# Altium schematic sheet zulu_a7_4.SchDoc
size 240 x 314 mm; Author: Christian Tambe; VERSION#: 1.0; Origin: Eagle; OriginPath: C:\Users\tambe\Documents\Electronics\Zulu_A7\Zulu_Altrium\zulu_a7.sch; OriginSheet: 5; OriginDescription: FT2232HL, JTAG, CLOCK
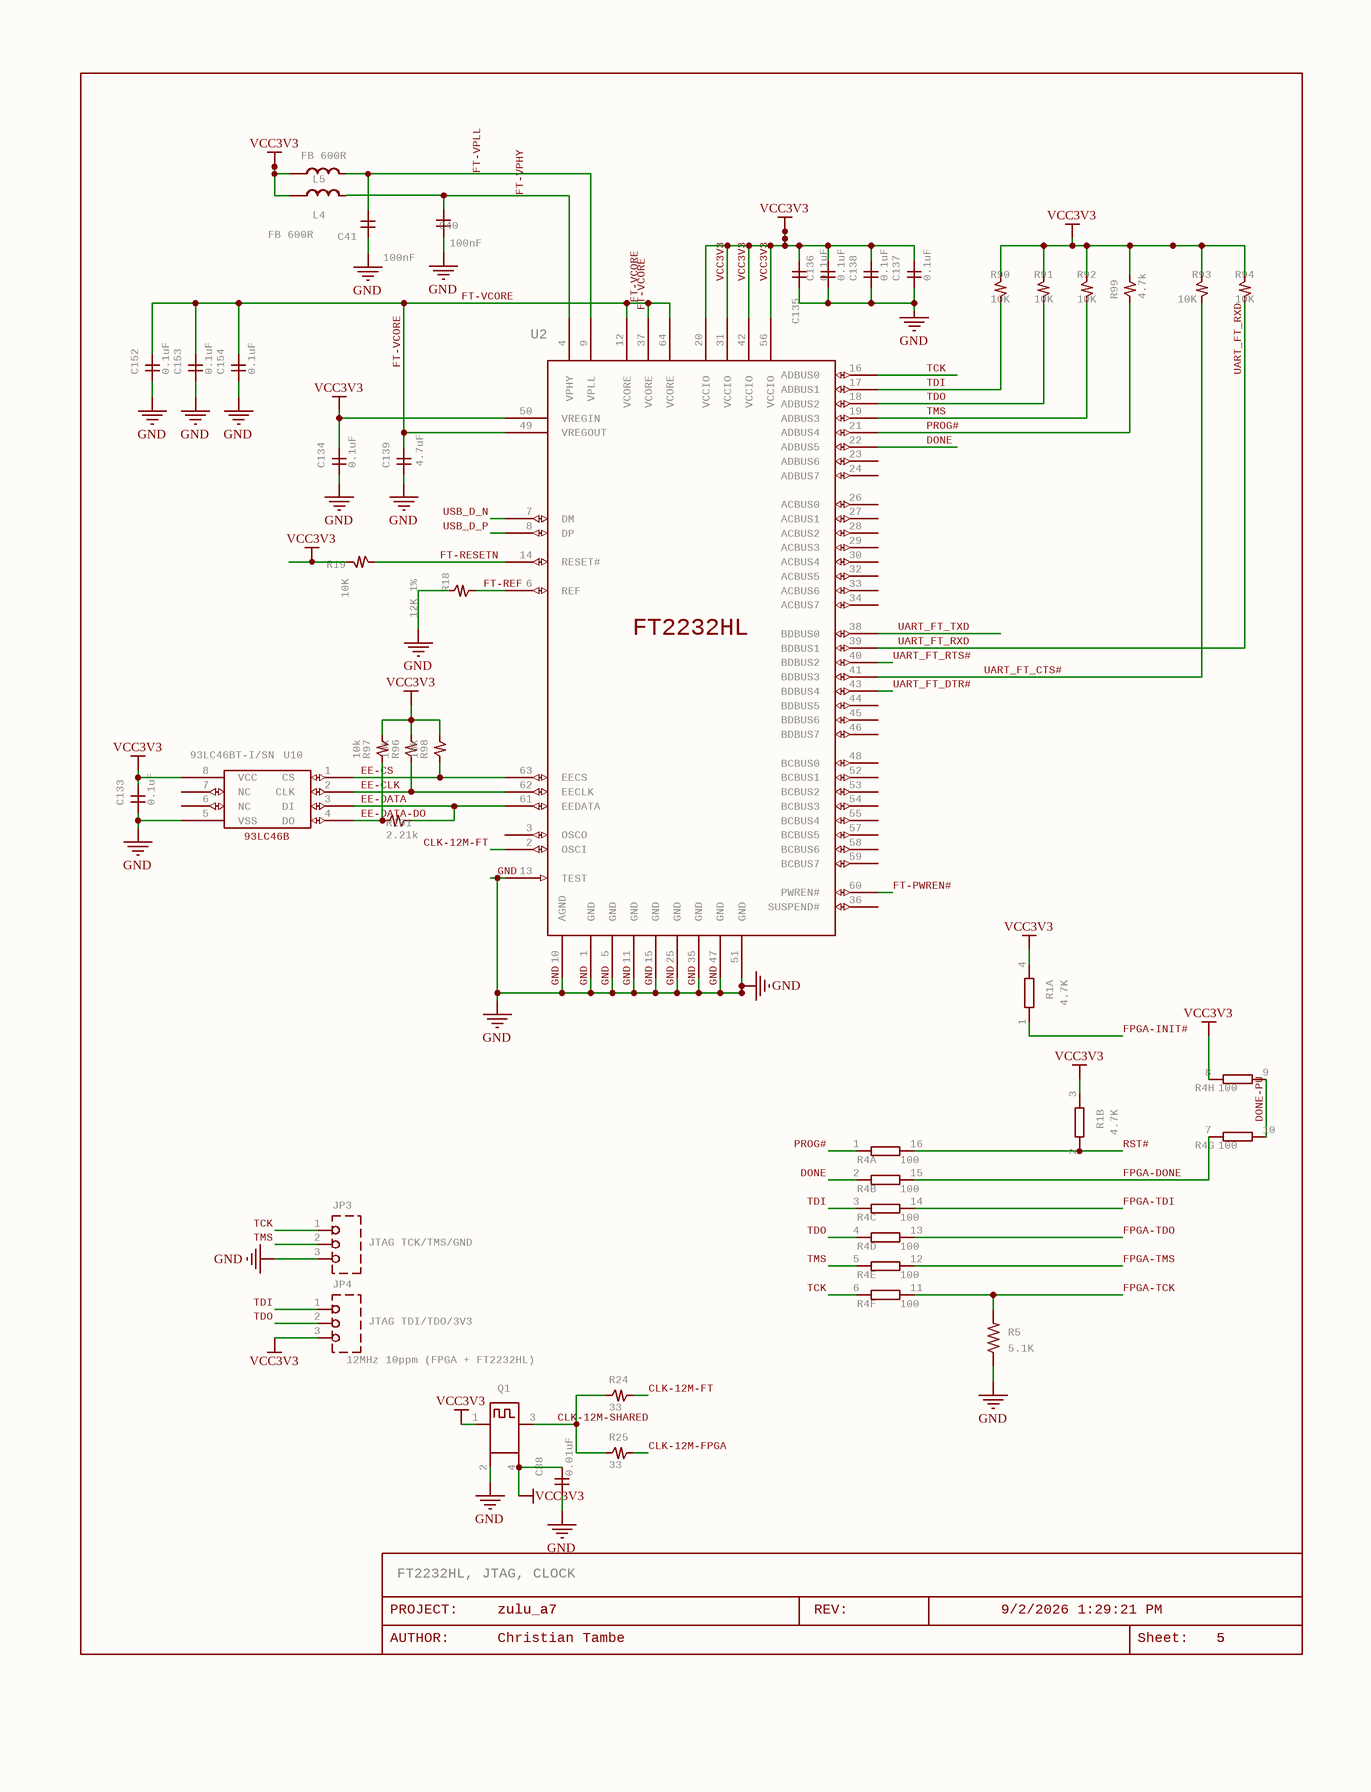
[diagram p0: zulu_a7_4.SchDoc]

## Parts
C38  0.01uF  [C0201]
C40  100nF  [C0201]
C41  100nF  [C0201]
C133  0.1uF  [C0201]
C134  0.1uF  [C0201]
C135  0.1uF  [C0201]
C136  0.1uF  [C0201]
C137  0.1uF  [C0201]
C138  0.1uF  [C0201]
C139  4.7uF  [C0402]
C152  0.1uF  [C0201]
C153  0.1uF  [C0201]
C154  0.1uF  [C0201]
FRAME4  LAST_DATE_TIME: 9/2/2026 1:29:21 PM  Sheet: Sheet:  SHEET: 5  REV: REV:  PROJECT: PROJECT:  DRAWING_NAME: zulu_a7  AUTHOR: Christian Tambe  (hidden comment: DOCFIELD)  (graphical)
JP3  JTAG TCK/TMS/GND  [1X03-NOSILK]
JP4  JTAG TDI/TDO/3V3  [1X03-NOSILK]
L4  FB 600R  [IND0603]
L5  FB 600R  [IND0603]
Q1  12MHz 10ppm (FPGA + FT2232HL)  [32X25]
R1  4.7K  [742C043]  (parts A,B of 2)
R4  100  [742C163]  (parts A,B,C,D,E,F,G,H of 8)
R5  5.1K  [R0201]
R18  12K 1%  [R0402]
R19  10K  [R0201]
R24  33  [R0201]
R25  33  [R0201]
R90  10K  [R0201]
R91  10K  [R0201]
R92  10K  [R0201]
R93  10K  [R0201]
R94  10K  [R0201]
R96  10k  [R0201]
R97  10k  [R0201]
R98  10k  [R0201]
R99  4.7k  [R0201]
R101  2.21k  [R0201]
U2  FT2232HL USB-UART/JTAG Bridge  [FT2232HL-LQFP64]  (value not drawn)
U10  93LC46BT-I/SN  [SPI-8_SOIC_150]

## Nets
GND: C38.1 C40.1 C41.1 C133.1 C134.1 C135.1 C136.1 C137.1 C138.1 C139.1 C152.1 C153.1 C154.1 JP3.3 Q1.2 R5.1 R18.1 U2.1(GND) U2.5(GND) U2.10(AGND) U2.11(GND) U2.13(TEST) U2.15(GND) U2.25(GND) U2.35(GND) U2.47(GND) U2.51(GND) U10.5(VSS)
VCC3V3: C38.2 C133.2 C134.2 C135.2 C136.2 C137.2 C138.2 JP4.3 L4.2 L5.2 Q1.1 Q1.4 R1.3 R1.4 R4.8 R19.2 R90.2 R91.2 R92.2 R93.2 R94.2 R96.2 R97.2 R98.2 R99.2 U2.20(VCCIO) U2.31(VCCIO) U2.42(VCCIO) U2.50(VREGIN) U2.56(VCCIO) U10.8(VCC)
CLK-12M-FPGA: R25.2
CLK-12M-FT: R24.2 U2.2(OSCI)
CLK-12M-SHARED: Q1.3 R24.1 R25.1
DONE: R4.2 U2.22(ADBUS5)
DONE-PU: R4.9 R4.10
EE-CLK: R96.1 U2.62(EECLK) U10.2(CLK)
EE-CS: R98.1 U2.63(EECS) U10.1(CS)
EE-DATA: R101.2 U2.61(EEDATA) U10.3(DI)
EE-DATA-DO: R97.1 R101.1 U10.4(DO)
FPGA-DONE: R4.7 R4.15
FPGA-INIT#: R1.1
FPGA-TCK: R4.11 R5.2
FPGA-TDI: R4.14
FPGA-TDO: R4.13
FPGA-TMS: R4.12
FT-PWREN#: U2.60(PWREN#)
FT-REF: R18.2 U2.6(REF)
FT-RESETN: R19.1 U2.14(RESET#)
FT-VCORE: C139.2 C152.2 C153.2 C154.2 U2.12(VCORE) U2.37(VCORE) U2.49(VREGOUT) U2.64(VCORE)
FT-VPHY: C40.2 L4.1 U2.4(VPHY)
FT-VPLL: C41.2 L5.1 U2.9(VPLL)
PROG#: R4.1 R99.1 U2.21(ADBUS4)
RST#: R1.2 R4.16
TCK: JP3.1 R4.6 U2.16(ADBUS0)
TDI: JP4.1 R4.3 R90.1 U2.17(ADBUS1)
TDO: JP4.2 R4.4 R91.1 U2.18(ADBUS2)
TMS: JP3.2 R4.5 R92.1 U2.19(ADBUS3)
UART_FT_CTS#: R93.1 U2.41(BDBUS3)
UART_FT_DTR#: U2.43(BDBUS4)
UART_FT_RTS#: U2.40(BDBUS2)
UART_FT_RXD: R94.1 U2.39(BDBUS1)
UART_FT_TXD: U2.38(BDBUS0)
USB_D_N: U2.7(DM)
USB_D_P: U2.8(DP)

Not connected (* = marked no-connect by the designer): U2 3(OSCO) 23(ADBUS6) 24(ADBUS7) 26(ACBUS0) 27(ACBUS1) 28(ACBUS2) 29(ACBUS3) 30(ACBUS4) 32(ACBUS5) 33(ACBUS6) 34(ACBUS7) 36(SUSPEND#) 44(BDBUS5) 45(BDBUS6) 46(BDBUS7) 48(BCBUS0) 52(BCBUS1) 53(BCBUS2) 54(BCBUS3) 55(BCBUS4) 57(BCBUS5) 58(BCBUS6) 59(BCBUS7); U10 6(NC) 7(NC)

## Notes on the sheet
- (near FRAME4) FT2232HL, JTAG, CLOCK
- (near FRAME4) AUTHOR:

## Library data of the parts
C38 = C-GENERICC0201: CAPACITOR, generic non-polarized, horizontal pins; GateName_1: G$1; SymbolName_1: C-GENERIC-H; MANF: Murata; MANF#: GRM033R71E103KE14D; NOTE: 0402 -> 0201 on U2's support. 50V drops to 25V, which is still far over what a 3.3V rail needs -- the 50V part was over-specified. Confirm the MPN suffix before ordering.; SPEC: X7R 25V +-10%, 0.30 mm max; DeviceName: C0201; LibraryName: rcl; DeviceSetName: C-GENERIC
C40 C41 C133-C138 = C-GENERICC0201: CAPACITOR, generic non-polarized, horizontal pins; GateName_1: G$1; SymbolName_1: C-GENERIC-H; MANF: Murata; MANF#: GRM033R61A104KE15D; NOTE: 0402 -> 0201 on U2's support. The DIELECTRIC AND VOLTAGE BOTH CHANGE: X7R 16V becomes X5R 10V, because 0201 at this capacitance is an X5R part. X5R narrows the temperature range to -55..+85 C from X7R's +125, which suits this board but is not a like-for-like swap. At 0.1 uF the DC bias derating is mild, unlike the 0.47 uF on sheet 7. Confirm the MPN suffix against Murata's data before ordering.; SPEC: X5R 10V +-10%, 0.30 mm max; DeviceName: C0201; LibraryName: rcl; DeviceSetName: C-GENERIC
C139 = C-GENERICC0402: CAPACITOR, generic non-polarized, horizontal pins; GateName_1: G$1; SymbolName_1: C-GENERIC-H; MANF: Taiyo Yuden; MANF#: MSASJ105BB5475MFNA01; SPEC: X5R 6.3V +-20% 0402 4.7uF, 0.65 mm max, about 3.7 uF left at 1.8 V; Digi-Key alias JMK105BBJ475MV-F (587-2787-1-ND, 1.6 M pcs); replaced the unobtainable 3.3 uF GRM155R60J335ME15D on the FT2232H VCORE node (FTDI minimum 3.3 uF) on 2026-09-08; DeviceName: C0402; LibraryName: rcl; DeviceSetName: C-GENERIC
C152-C154 = C-GENERICC0201: CAPACITOR, generic non-polarized, horizontal pins; GateName_1: G$1; SymbolName_1: C-GENERIC-H; MANF: Murata; MANF#: GRM033R61A104KE15D; NOTE: FT2232H core-rail decoupling. DS_FT2232H Figures 4.1 and 6.1 show a 100 nF at each VCORE pin besides the 4.7 uF bulk (C39, C139); the board had the bulk and none of these. Same part as the eight 0.1 uF and 100 nF 0201 capacitors already on this sheet, so no new BOM line. AT LAYOUT: put one beside each of pins 12, 37 and 64 with the shortest ground return you can manage -- that placement is the whole point of them.; SPEC: X5R 10V +-10% 0201 0.1uF, 0.30 mm max -- one per FT2232H VCORE pin, added 2026-09-09 after docs/connectivity_check.md found the core rail carrying bulk only; DeviceName: C0201; LibraryName: rcl; DeviceSetName: C-GENERIC
FRAME4 = DOCFIELD: DOCUMENT FIELD; GateName_1: G$1; SymbolName_1: DOCFIELD; LibraryName: ctambe; DeviceSetName: DOCFIELD
JP3 = TESTPT-1X3NOSILK: Three plated holes, 1x3 on 2.54 mm   NOT a fitted header, which is why it is no longer called one. The footprint is an ordinary 1x3 header pattern and a strip could be soldered in for bring-up, but nothing is populated: a 1x3 body clears the Pmod shroud beside it by 0.09 mm, inside anyone's assembly tolerance. Drawn dashed with open holes so the sheet stops reading as a connector, the way the 2x3 it replaced did.; SymbolName_1: TP1X3; DeviceName: NOSILK; NOTE: Bare plated holes -- NO HEADER FITTED, nothing to order. Three of the six JTAG holes; JP4 carries the other three, 17.96 mm away on the far side of the Pmod. Each row has 3.05 mm of board to the Pmod but only 0.09 mm to a 1x3 strip's body, so these are for flying leads or a pogo jig. The FT2232 does JTAG over USB on channel B; this is the fallback.; DNS: Yes; SPEC: DNS - do not stuff: three bare plated holes, 1x3 on 2.54 mm, for flying leads or pogo pins; no part to order (flagged 2026-09-08); GateName_1: A; LibraryName: pinhead; DeviceSetName: TESTPT-1X3
JP4 = TESTPT-1X3NOSILK: Three plated holes, 1x3 on 2.54 mm   NOT a fitted header, which is why it is no longer called one. The footprint is an ordinary 1x3 header pattern and a strip could be soldered in for bring-up, but nothing is populated: a 1x3 body clears the Pmod shroud beside it by 0.09 mm, inside anyone's assembly tolerance. Drawn dashed with open holes so the sheet stops reading as a connector, the way the 2x3 it replaced did.; SymbolName_1: TP1X3; DeviceName: NOSILK; NOTE: Bare plated holes -- NO HEADER FITTED, nothing to order. Three of the six JTAG holes; JP3 carries the other three, 17.96 mm away on the far side of the Pmod. Each row has 3.05 mm of board to the Pmod but only 0.09 mm to a 1x3 strip's body, so these are for flying leads or a pogo jig. The FT2232 does JTAG over USB on channel B; this is the fallback.; DNS: Yes; SPEC: DNS - do not stuff: three bare plated holes, 1x3 on 2.54 mm, for flying leads or pogo pins; no part to order (flagged 2026-09-08); GateName_1: A; LibraryName: pinhead; DeviceSetName: TESTPT-1X3
L4 L5 = INDUCTOR: INDUCTOR, generic power inductor; GateName_1: G$1; MANF: Murata; MANF#: BLM18KG601SN1D; SPEC: ferrite bead 600 ohm at 100 MHz +-25%, 1.3 A at 85 C, 0.15 ohm max, 0603, 0.90 mm max; replaced BLM18PG601SN1D (a number Murata never made; the spec 600 ohm/1.5 A is BLM18SP601SN1D) on 2026-09-08; L4/L5 feed the FT2232H VPHY/VPLL (60 mA max), L6 GNDADC, L7 VCCADC (25 mA); SymbolName_1: INDUCTOR; LibraryName: ctambe; DeviceSetName: INDUCTOR
Q1 = OSC_CHIPASEM1-12MHZ: Crystal Chip; GateName_1: G$1; DeviceName: ECS-3225SMV; MANF: ECS; MANF#: ECS-3225SMV-120-FP-TR; NOTE: ACTIVE OSCILLATOR, NOT A CRYSTAL -- the schematic settles it: pin 2 to GND, pin 4 to VCC3V3, pin 3 out into R24 and R25, and pin 1 tied to VCC3V3, which is a 4-pad XO with its enable held high. A crystal would have two pads and load capacitors. THE FREQUENCY IS NOT A CHOICE: the FT2232H wants 12 MHz for its USB PLL, so that was fixed before anything else. 25 ppm is the value already recorded and is comfortably inside what FTDI asks of the reference. Output drives two loads through 33R each, the FT2232's OSCI and the FPGA clock ball. Pin 1 to Vdd suits either an OE part or one with pin 1 not connected, so the choice is not narrowed by it. ASEM1 is the family the design note already named. Confirm the suffix -- it encodes stability and temperature range and is the easy thing to get wrong.; SPEC: 12.000 MHz HCMOS XO, 1.62-3.63 V, +-10 ppm incl. initial, temp -40..105 C, supply, load, reflow and aging (ECS-3225SMV sheet p1), 3.2x2.5x1.2 mm, pin 1 tri-state (H/NC = run), 6 mA typ / 10 mA max; replaced the +-50 ppm ASEM1-12.000MHZ-LC-T on 2026-09-08; SymbolName_1: OSC_CHIP; LibraryName: ctambe; DeviceSetName: OSC_CHIP
R1 = RES2742: Resistor 2-pack   Package of two resistors.; GateName_1: A; SymbolName_1: R1NV0; GateName_2: B; DeviceName: 742; DeviceSetName: RES2; MANF: CTS; MANF#: 742C043472JP; SPEC: 2 x 4.7K +-5% isolated array, 0606 concave 1.60 x 1.60 mm, 0.80 mm pitch, 63 mW per element; NOTE: The two configuration pull-ups in one package: A on INIT_B (net FPGA-INIT#), B on PROGRAM_B (net RST#). Both commons are pads 3 and 4, side by side on one long side of the body, and both go to VCC3V3. CTS publishes ONE recommended land pattern for the whole 742 package family, so this footprint is the 742C083 pad cell already validated for R34 with two pads per side instead of four. 5 percent: the 742C043 has no 1 percent option either, and a configuration pull-up does not care; 63 mW per element against the 2.3 mW that 3.3 V across 4.7 k actually dissipates. Alternate on the identical land: Panasonic EXB-V4V472JV, same 1.60 x 1.60 mm concave body on 0.80 mm pitch. Do NOT substitute EXB-34V472JV -- same size, convex terminals, different land. R99, the third 4.7 k pull-up on this sheet, stays discrete: it sits on PROG#, the far side of the 100 ohm now in R4. TOLERANCE AGAINST UG470: Table 2-4 asks for a pull-up of 4.7 kohm OR LESS on both of these pins, and this is a 5 percent part, so its worst case is 4.935 k -- 5 percent outside the stated maximum. That is a wording problem rather than a physical one. The limit exists to hold the pin high against input leakage, and DS181 worst-case leakage of 15 uA across 4.935 k is 74 mV, against a VIH of 2.0 V. The discretes this replaces were 1 percent parts and were already outside the same limit, at 4.747 k. Strict compliance would mean 4.3 kohm +-5 percent (4.515 k worst case), but CTS does not stock a 432 code in the 742C043 family -- the stocked spread is 101, 220, 470, 471, 472, 473, 102, 103 and 104 -- so buying compliance here would cost availability, which is the thing that actually stops a board getting built. Dropping to the next stocked value, 1 k, would cost margin where it matters: it lifts the low level the bridge can assert on RST# through the 100 ohm from 0.10 V to 0.43 V.; SymbolName_2: R1NV0; LibraryName: ctambe
R4 = RES8742: Resistor 8-pack   Package of eight resistors, six used.; GateName_1: A; SymbolName_1: R1NV0; GateName_2: B; GateName_3: C; GateName_4: D; GateName_5: E; GateName_6: F; GateName_7: G; GateName_8: H; DeviceName: 742; DeviceSetName: RES8; MANF: CTS; MANF#: 742C163101JP; SPEC: 8 x 100 ohm +-5% isolated array, 2506 concave 6.40 x 1.60 mm, 0.80 mm pitch, 63 mW per element; six elements used, two spare; NOTE: The six 100 ohm series resistors between the FT2232H and the FPGA in one package: A PROG#, B DONE, C TDI, D TDO, E TMS, F TCK, in the order they are drawn down the sheet. Pads 1-6 face the bridge and pads 16-11 face the FPGA, one long side of the body per end of the link. TWO ELEMENTS ARE SPARE (pads 7-10); they sit at the far end of the body, so the six used run contiguously from pad 1. Leave the spare pads unconnected. There is no purchasable 6-element part: CTS 753123101GP is a genuine 12-terminal, 6-isolated-element, 100 ohm array, but Digi-Key holds none, quotes 28 weeks at MOQ 1000 and $2.63 each, and its 12-SRT body is 8.76 x 2.03 mm, LARGER than this 8-element chip array. Same CTS 74x concave family as R34, so all three arrays on the board answer to one CTS land-pattern rule (0.45 x 0.80 mm pads, 0.80 mm pitch, 2.60 mm across). 5 percent like R34: the 742C163 has no 1 percent option, which series damping does not care about, and 63 mW per element is twenty times the worst case. Alternate if the layout needs the length back: Panasonic EXB-2HV101JV is the same 8 x 100 ohm isolated in 3.80 x 1.60 mm, but convex terminals on 0.50 mm pitch, so it needs its own land pattern. AT LAYOUT: all six lines now converge on one part -- put it between the bridge and the FPGA where the four JTAG lines already run together, and keep TCK, element F on pads 6/11, at the end of the body: its only live neighbour is TMS. SUPPLY CAVEATS, all read 2026-09-09. (1) CTS files the whole 74x series -- this part and R34's 742C083 with it -- under Legacy Products on its own site. Near-term risk is low: 25,352 stocked, MOQ 1, deep sibling stock. It is not a young family. (2) There is no drop-in second source on this land. The alternate above needs its own footprint, so this one package is a single point of failure where the six discretes it replaces had many interchangeable vendors; if that matters for the build, qualify a second 16-pad 0.80 mm concave array on the same land first. (3) Every stock and price figure here is Digi-Key alone -- Mouser, Arrow, TTI, Octopart and LCSC all refused automated reads that day -- so none of it has second-distributor corroboration. AND ONE LAYOUT POINT: the two spare elements are unplaced, so pads 7-10 carry no net. If the layout wants them as grounded metal beside TCK, that has to come back here as two more placed gates with both ends on GND; it cannot be done in the PCB alone.; SymbolName_2: R1NV0; SymbolName_3: R1NV0; SymbolName_4: R1NV0; SymbolName_5: R1NV0; SymbolName_6: R1NV0; SymbolName_7: R1NV0; SymbolName_8: R1NV0; LibraryName: ctambe
R5 = R-US_R0201: RESISTOR, American symbol; GateName_1: G$1; SymbolName_1: R-US; DeviceSetName: R-US_; MANF: Yageo; MANF#: RC0201FR-075K1L; SPEC: thick film +-1%, 1/20W, 0201; DeviceName: R0201; LibraryName: rcl; MOUSER#: 301-5.1K-RC
R18 = R-US_SMALLR0402: RESISTOR, American symbol, small 2-zigzag variant (sheet 2 only); GateName_1: G$1; MANF: Yageo; MANF#: RC0402FR-0712KL; NOTE: Stays 0402 deliberately. Power is trivial (0.9 mW) and 1 percent is 1 percent at any size, but this is the FT2232's RREF -- it sets the USB transceiver bias current. There is no space pressure on this board any more, so there is nothing to gain against a part whose drift shows up as USB signal quality.; SPEC: thick film +-1%, 1/16W, 0402; SymbolName_1: R-US_SMALL; DeviceName: R0402; LibraryName: rcl; DeviceSetName: R-US_SMALL
R19 R90-R94 R96-R98 = R-US_SMALLR0201: RESISTOR, American symbol, small 2-zigzag variant (sheet 2 only); GateName_1: G$1; MANF: Yageo; MANF#: RC0201FR-0710KL; SPEC: thick film +-1%, 1/20W, 0201; SymbolName_1: R-US_SMALL; DeviceName: R0201; LibraryName: rcl; DeviceSetName: R-US_SMALL
R24 R25 = R-US_SMALLR0201: RESISTOR, American symbol, small 2-zigzag variant (sheet 2 only); GateName_1: G$1; MANF: Yageo; MANF#: RC0201FR-0733RL; SPEC: thick film +-1%, 1/20W, 0201; SymbolName_1: R-US_SMALL; DeviceName: R0201; LibraryName: rcl; DeviceSetName: R-US_SMALL
R99 = R-US_SMALLR0201: RESISTOR, American symbol, small 2-zigzag variant (sheet 2 only); GateName_1: G$1; MANF: Yageo; MANF#: RC0201FR-074K7L; SPEC: thick film +-1%, 1/20W, 0201; SymbolName_1: R-US_SMALL; DeviceName: R0201; LibraryName: rcl; DeviceSetName: R-US_SMALL
R101 = R-US_SMALLR0201: RESISTOR, American symbol, small 2-zigzag variant (sheet 2 only); GateName_1: G$1; MANF: Yageo; MANF#: RC0201FR-072K21L; SPEC: thick film +-1%, 1/20W, 0201; SymbolName_1: R-US_SMALL; DeviceName: R0201; LibraryName: rcl; DeviceSetName: R-US_SMALL
U2 = FT2232HQ-QFN64: FTDI FT2232HL Dual USB-UART/MPSSE Bridge, LQFP-64. Channel A = MPSSE JTAG to the FPGA (ADBUS0-3 = TCK/TDI/TDO/TMS, ADBUS4/5 = PROG#/DONE). Channel B = UART (BDBUS0-4 = TXD/RXD/RTS#/CTS#/DTR#). Same pin numbering as the FT2232HQ, no exposed pad. Replaced the FT2232HQ on 2026-09-09.; GateName_1: G$1; SymbolName_1: FT2232HQ-BOX; DeviceName: -LQFP64; MANF#: FT2232HL-REEL; SPEC: USB 2.0 Hi-Speed dual-channel UART/FIFO/MPSSE bridge, LQFP-64 10 x 10 mm body, 12 x 12 mm over leads, 0.5 mm pitch, JEDEC MS-026 BCD, no exposed pad; same die and pin numbering as the FT2232HQ (DS_FT2232H v2.10 section 3.1); channel A MPSSE JTAG + PROG#/DONE, channel B UART; 12 MHz CMOS oscillator into OSCI, internal 1.8 V regulator, 93LC46B EEPROM, REF 12 k; replaced the FT2232HQ (0 stock until April 2027) on 2026-09-09; NOTE: FT2232HL-REEL: Digi-Key 0 with 1,000 expected 19-Feb-2027 ($5.30, 50-week lead); LCSC C27882 4,767 in stock at $11.45 (not an FTDI-authorized channel: name it explicitly or consign for a PCBWay build). Pin numbers unchanged from the FT2232HQ; the QFN exposed pad (pin EP, GND) has no LQFP counterpart, so that pin and its ground stub were removed. thetaJA 37.66 C/W for the LQFP vs 29.67 for the QFN (DS_FT2232H Table 5.7). Footprint FT2232HL-LQFP64 to be drawn from Figure 8.2 or FTDI TN_166. Alternates on the same pin numbers: FT2232HQ (QFN-64) and FT4232HL / FT4232HQ (UART lands on channel C, EEPROM re-templated, PID 0x6011); the FT2232H-56Q keeps every signal but renumbers every pin.; LibraryName: ctambe; DeviceSetName: FT2232HL; FT2232HL: FT2232HL; MANF: FTDI
U10 = EEPROM-93LC46B-I/SN: Microchip 93LC46BT-I/SN, FTDI EEPROM (USB VID/PID/descriptors)   64 x 16 = 1 Kbit. DS_FT2232H p27: "The EEPROM should be a 16 bit wide configuration such as a Microchip 93LC46B or equivalent capable of a 1 Mbit/s clock rate at VCC = +3.00 V to 3.6 V." The B suffix is the fixed x16 organisation, so pins 6 and 7 are both no-connect; only the selectable C variant puts ORG on pin 6.; GateName_1: G$1; SymbolName_1: EEPROM-93LC46B-BOX; DeviceName: -I/SN; LibraryName: ctambe; DeviceSetName: EEPROM-93LC46B; 93LC46B: 93LC46B; MANF: Microchip; MANF#: 93LC46BT-I/SN